# Altium project PlacaGpsImu.PrjPcb
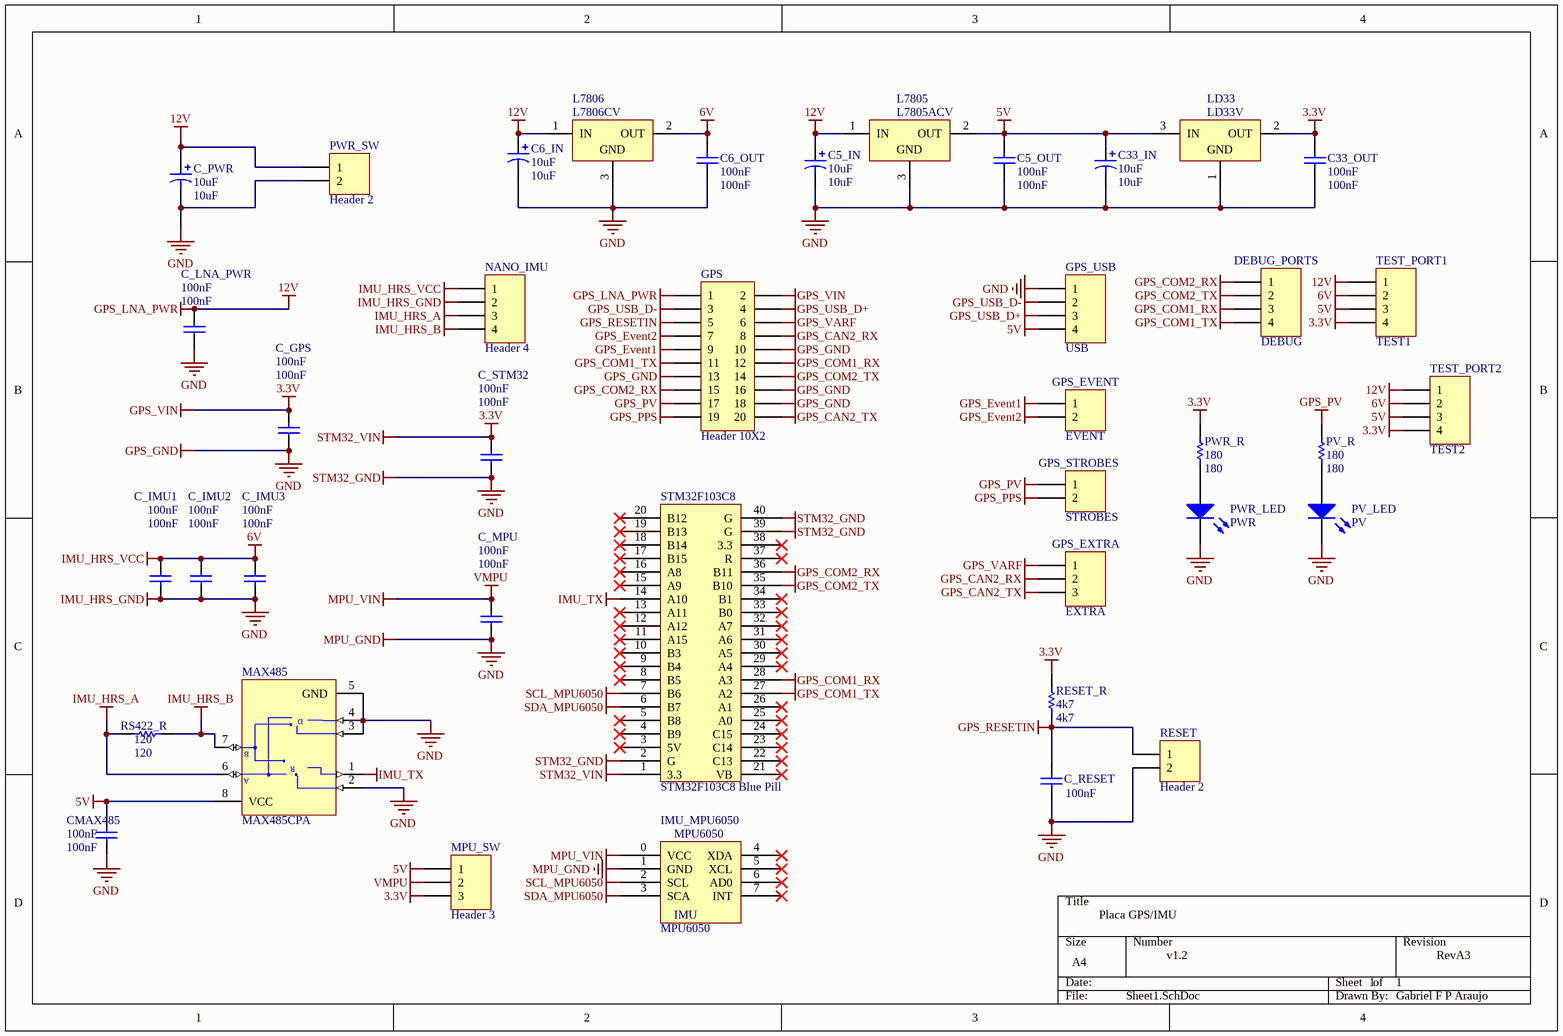
[diagram p0: Sheet1.SchDoc]
1 sheet, 40 parts. Net scope: global (net labels, ports and power ports of the same name join across sheets).
Board files: gps_imu.PcbDoc, gps_imu2.PcbDoc

## Sheet Sheet1.SchDoc
size A4

### Parts
C5_IN  10uF  [Capacitor1]
C5_OUT  100nF  [C_NANO_HOLES]
C6_IN  10uF  [Capacitor1]
C6_OUT  100nF  [C_NANO_HOLES]
C33_IN  10uF  [Capacitor1]
C33_OUT  100nF  [C_NANO_HOLES]
C_GPS  100nF  [C_NANO_HOLES]
C_IMU1  100nF  [C_NANO_HOLES]
C_IMU2  100nF  [C_NANO_HOLES]
C_IMU3  100nF  [C_NANO_HOLES]
C_LNA_PWR  100nF  [C_NANO_HOLES]
C_MPU  100nF  [C_NANO_HOLES]
C_PWR  10uF  [Capacitor1]
C_RESET  100nF  [C_NANO_HOLES]
C_STM32  100nF  [C_NANO_HOLES]
CMAX485  100nF  [C_NANO_HOLES]
DEBUG_PORTS  DEBUG  [HDR1X4]
GPS  Header 10X2  [HDR2x10_2mm]
GPS_EVENT  EVENT  [HDR1X2]
GPS_EXTRA  EXTRA  [HDR1X3]
GPS_STROBES  STROBES  [HDR1X2]
GPS_USB  USB  [HDR1X4]
IMU_MPU6050  MPU6050  [MPU6050]
L7805  L7805ACV  [TO220ABN]
L7806  L7806CV  [TO220ABN]
LD33  LD33V  [T03B]
MAX485  MAX485CPA  [PA8]
MPU_SW  Header 3  [HDR1X3]
NANO_IMU  Header 4  [HDR1X4]
PV_LED  PV  [HDR1X2]
PV_R  180  [AXIAL-0.3]
PWR_LED  PWR  [HDR1X2]
PWR_R  180  [AXIAL-0.3]
PWR_SW  Header 2  [HDR1X2]
RESET  Header 2  [HDR1X2]
RESET_R  4k7  [AXIAL-0.3]
RS422_R  120  [AXIAL-0.3]
STM32F103C8  STM32F103C8 Blue Pill  [STM32F103C8]
TEST_PORT1  TEST1  [HDR1X4]
TEST_PORT2  TEST2  [HDR1X4]

### Nets
3.3V: C33_OUT.1 C_GPS.2 C_STM32.2 GPS.2 LD33.2(OUT) MPU_SW.3 PWR_R.2 RESET_R.2 STM32F103C8.1(3.3) TEST_PORT1.4 TEST_PORT2.4  [also labelled GPS_VIN, STM32_VIN]
5V: C5_OUT.1 C33_IN.1 CMAX485.2 GPS_USB.4 L7805.2(OUT) LD33.3(IN) MAX485.8(VCC) MPU_SW.1 TEST_PORT1.3 TEST_PORT2.3
6V: C6_OUT.1 C_IMU1.2 C_IMU2.2 C_IMU3.2 L7806.2(OUT) NANO_IMU.1 TEST_PORT1.2 TEST_PORT2.2  [also labelled IMU_HRS_VCC]
12V: C5_IN.1 C6_IN.1 C_LNA_PWR.2 C_PWR.1 GPS.1 L7805.1(IN) L7806.1(IN) PWR_SW.1 TEST_PORT1.1 TEST_PORT2.1  [also labelled GPS_LNA_PWR]
GND: C5_IN.2 C5_OUT.2 C6_IN.2 C6_OUT.2 C33_IN.2 C33_OUT.2 C_GPS.1 C_IMU1.1 C_IMU2.1 C_IMU3.1 C_LNA_PWR.1 C_MPU.1 C_PWR.2 C_RESET.1 C_STM32.1 CMAX485.1 GPS.10 GPS.13 GPS.16 GPS.18 GPS_USB.1 IMU_MPU6050.1(GND) L7805.3(GND) L7806.3(GND) LD33.1(GND) MAX485.2(~{RE}) MAX485.3(DE) MAX485.4(DI) MAX485.5(GND) NANO_IMU.2 PV_LED.2(K) PWR_LED.2(K) PWR_SW.2 RESET.2 STM32F103C8.2(G) STM32F103C8.39(G) STM32F103C8.40(G)  [also labelled GPS_GND, IMU_HRS_GND, MPU_GND, STM32_GND]
GPS_CAN2_RX: GPS.8 GPS_EXTRA.2
GPS_CAN2_TX: GPS.20 GPS_EXTRA.3
GPS_COM1_RX: DEBUG_PORTS.3 GPS.12 STM32F103C8.28(A3)
GPS_COM1_TX: DEBUG_PORTS.4 GPS.11 STM32F103C8.27(A2)
GPS_COM2_RX: DEBUG_PORTS.1 GPS.15 STM32F103C8.36(B11)
GPS_COM2_TX: DEBUG_PORTS.2 GPS.14 STM32F103C8.35(B10)
GPS_Event1: GPS.9 GPS_EVENT.1
GPS_Event2: GPS.7 GPS_EVENT.2
GPS_PPS: GPS.19 GPS_STROBES.2
GPS_PV: GPS.17 GPS_STROBES.1 PV_R.2
GPS_RESETIN: C_RESET.2 GPS.5 RESET.1 RESET_R.1
GPS_USB_D+: GPS.4 GPS_USB.3
GPS_USB_D-: GPS.3 GPS_USB.2
GPS_VARF: GPS.6 GPS_EXTRA.1
IMU_HRS_A: MAX485.6(A) NANO_IMU.3 RS422_R.1
IMU_HRS_B: MAX485.7(B) NANO_IMU.4 RS422_R.2
IMU_TX: MAX485.1(RO) STM32F103C8.14(A10)
MPU_VIN: C_MPU.2 IMU_MPU6050.0(VCC) MPU_SW.2  [also labelled VMPU]
SCL_MPU6050: IMU_MPU6050.2(SCL) STM32F103C8.7(B6)
SDA_MPU6050: IMU_MPU6050.3(SCA) STM32F103C8.6(B7)
NetPV_LED_1: PV_LED.1(A) PV_R.1
NetPWR_LED_1: PWR_LED.1(A) PWR_R.1

Not connected (* = marked no-connect by the designer): IMU_MPU6050 4(XDA)* 5(XCL)* 6(AD0)* 7(INT)*; STM32F103C8 3(5V)* 4(B9)* 5(B8)* 8(B5)* 9(B4)* 10(B3)* 11(A15)* 12(A12)* 13(A11)* 15(A9)* 16(A8)* 17(B15)* 18(B14)* 19(B13)* 20(B12)* 21(VB)* 22(C13)* 23(C14)* 24(C15)* 25(A0)* 26(A1)* 29(A4)* 30(A5)* 31(A6)* 32(A7)* 33(B0)* 34(B1)* 37(R)* 38(3.3)*

### Notes on the sheet
- Placa GPS/IMU
- v1.2
- 1
- RevA3
- Gabriel F P Araujo
- (in symbol Component_1) IMU
- (in symbol MAX485CPA) D; R

### Library data of the parts
C5_IN C6_IN C33_IN C_PWR = Cap Pol1: Polarized Capacitor (Radial); Published: 8-Jun-2000; LatestRevisionDate: 17-Jul-2002; LatestRevisionNote: Re-released for DXP Platform.; PackageReference: RB7.6-15; Publisher: Altium Limited; PackageDescription: Polarized Capacitor (Radial); 2 Leads; Value: 10uF
C5_OUT C6_OUT C33_OUT C_GPS C_IMU1-C_IMU3 C_LNA_PWR C_MPU C_RESET C_STM32 CMAX485 = Cap: Capacitor; Published: 8-Jun-2000; LatestRevisionDate: 17-Jul-2002; LatestRevisionNote: Re-released for DXP Platform.; PackageReference: RAD-0.3; Publisher: Altium Limited; Value: 100nF
DEBUG_PORTS GPS_USB NANO_IMU TEST_PORT1 TEST_PORT2 = Header 4: Header, 4-Pin; LatestRevisionDate: 17-Jul-2002; LatestRevisionNote: Re-released for DXP Platform.; Publisher: Altium Limited
GPS = Header 10X2: Header, 10-Pin, Dual row; LatestRevisionDate: 17-Jul-2002; LatestRevisionNote: Re-released for DXP Platform.; Publisher: Altium Limited
GPS_EVENT GPS_STROBES PWR_SW RESET = Header 2: Header, 2-Pin; LatestRevisionDate: 17-Jul-2002; LatestRevisionNote: Re-released for DXP Platform.; Publisher: Altium Limited
GPS_EXTRA MPU_SW = Header 3: Header, 3-Pin; LatestRevisionDate: 17-Jul-2002; LatestRevisionNote: Re-released for DXP Platform.; Publisher: Altium Limited
IMU_MPU6050 = Component_1
L7805 = L7805ACV: Precision 1A Regulator; Note: Tab is connected to pin 3 (GND).; Published: 24-Aug-2001; LatestRevisionDate: 17-Jul-2002; LatestRevisionNote: Re-released for DXP Platform.; DatasheetVersion: Nov-1999; PackageVersion: Jun-1998; PackageReference: TO220ABN; Publisher: Altium Limited; PackageDescription: TO, Thru-Hole, Vertical, Heatsink Mounted; 3 In-Line Leads; Pitch 2.54 mm; Pin sequence 1, 3, 2; ComponentLink1Description: Manufacturer Link; ComponentLink1URL: http://www.st.com/; ComponentLink2Description: Datasheet; ComponentLink2URL: http://www.st.com/stonline/products/literature/ds/2144/l7805ab.pdf
L7806 = L7806CV: Positive Voltage Regulator; Note: Tab is connected to pin 3 (GND).; Published: 24-Aug-2001; LatestRevisionDate: 17-Jul-2002; LatestRevisionNote: Re-released for DXP Platform.; DatasheetVersion: Dec-1998; PackageVersion: Jun-1998; PackageReference: TO220ABN; Publisher: Altium Limited; PackageDescription: TO, Thru-Hole, Vertical, Heatsink Mounted; 3 In-Line Leads; Pitch 2.54 mm; Pin sequence 1, 3, 2; ComponentLink1Description: Manufacturer Link; ComponentLink1URL: http://www.st.com/
LD33 = LM1117T-3.3: 800mA Low-Dropout Linear Regulator; Manufacturer: National Semiconductor; CompType: LDO IC; PackageTopMarking: NSUZXYTTE#*LM1117T*3.3; Published: 4-Dec-2008; DatasheetVersion: Apr-2006; PackageVersion: revL, Jan-1992; PackageReference: T03B; Publisher: Altium Limited; PackageDescription: TO-220, Molded, 3 Lead, Straight; PartNumber: LM1117T-3.3; RoHS: O; PinCount: 3; DigiKeyPartNumber: LM1117T-3.3-ND; ComponentLink1Description: LM1117 Datasheet; ComponentLink1URL: http://www.national.com/ds/LM/LM1117.pdf; ComponentLink2Description: LM1117 Web Page; ComponentLink2URL: http://www.national.com/pf/LM/LM1117.html; ComponentLink3Description: T03B Package Page; ComponentLink3URL: http://www.national.com/packaging/folders/t03b.html
MAX485 = MAX485CPA: Low-Power, Slew-Rate-Limited RS-485/RS-422 Transceiver; Published: 16-Jan-2001; LatestRevisionDate: 29-May-2009; LatestRevisionNote: Component Body Added.; DatasheetVersion: Feb-1996; PackageVersion: RevB, 21-0043; PackageReference: PA8; Publisher: Altium Limited; PackageDescription: DIP, 8-Pin, Row Spacing 7.62 mm, Pitch 2.54 mm; Code_JEDEC: MS-001-AB; ComponentLink1Description: Manufacturer Link; ComponentLink1URL: http://www.maxim-ic.com/; ComponentLink2Description: Datasheet; ComponentLink2URL: http://pdfserv.maxim-ic.com/en/ds/MAX1487-MAX491.pdf
PV_LED PWR_LED = LED0: Typical INFRARED GaAs LED; Published: 8-Jun-2000; LatestRevisionDate: 08-Jul-2005; LatestRevisionNote: Mech Layer 1 removed.; PackageReference: LED-0; Publisher: Altium Limited
PV_R PWR_R RESET_R RS422_R = Res1: Resistor; Published: 8-Jun-2000; LatestRevisionDate: 17-Jul-2002; LatestRevisionNote: Re-released for DXP Platform.; PackageReference: AXIAL-0.3; Publisher: Altium Limited
  PV_R PWR_R: Value: 180
  RESET_R: Value: 4k7
  RS422_R: Value: 120
STM32F103C8 = STM32F103C8